# EAGLE board bms_master (EAGLE 6.2)
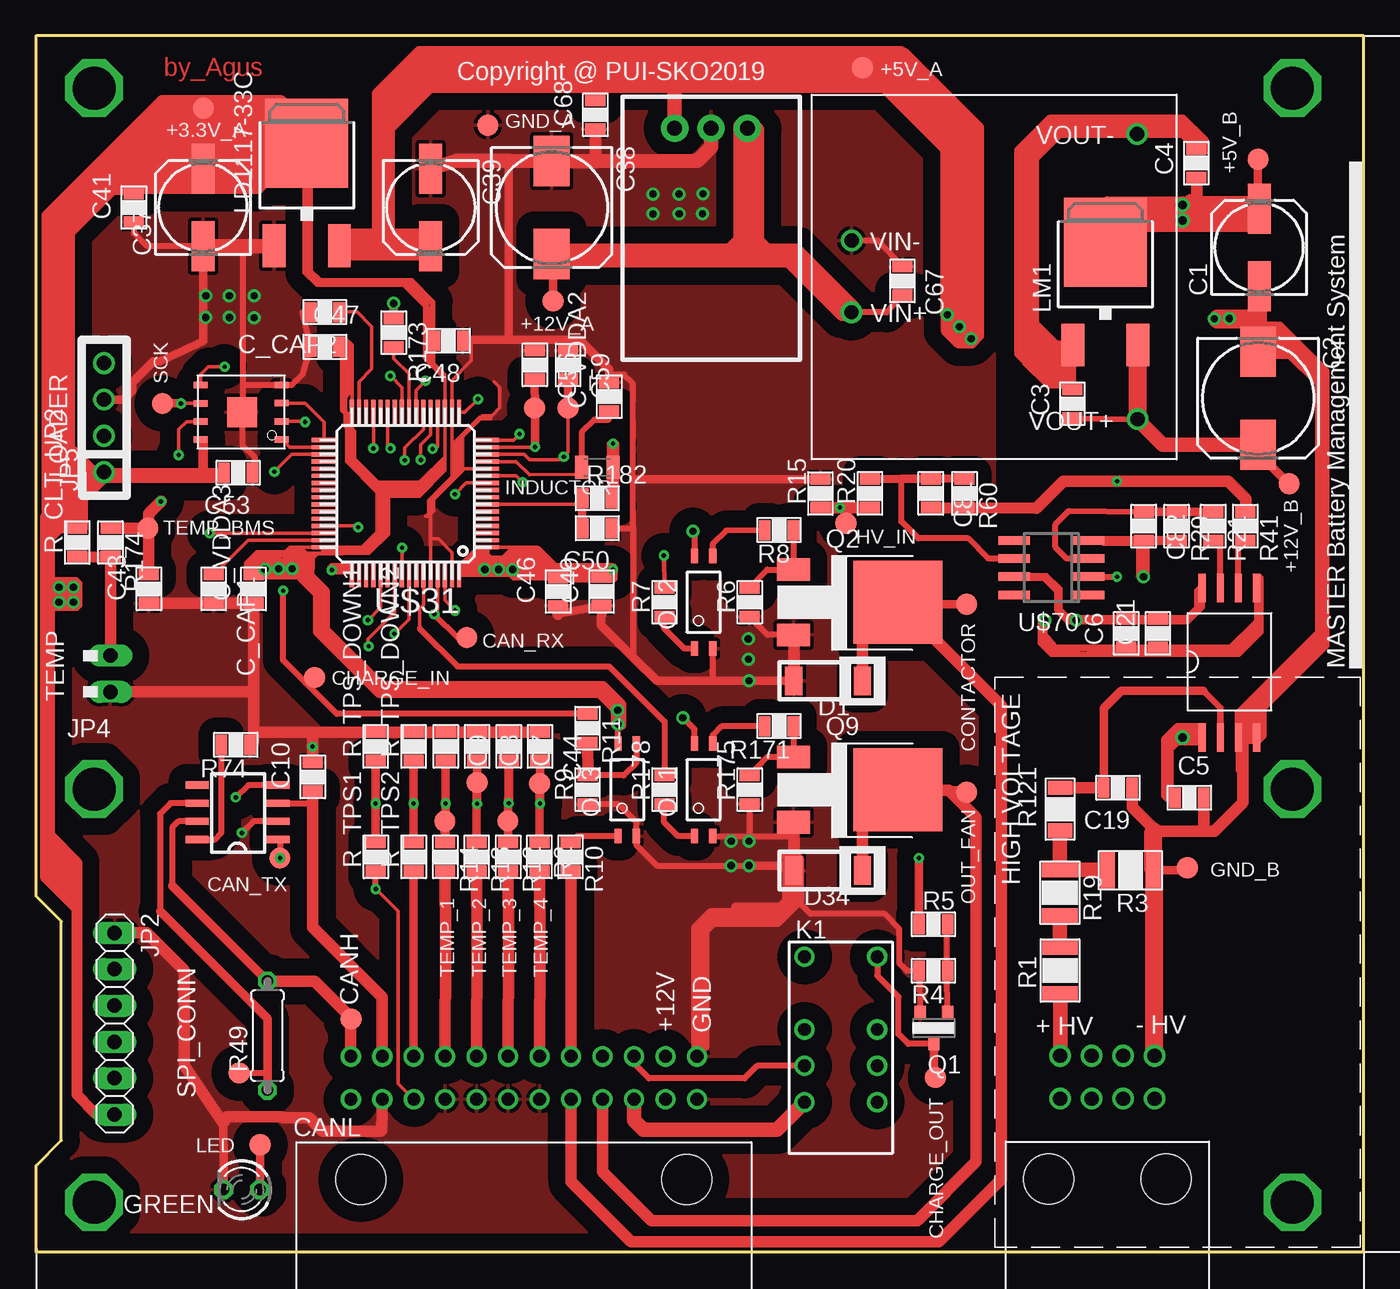
[diagram p1: board, top side]
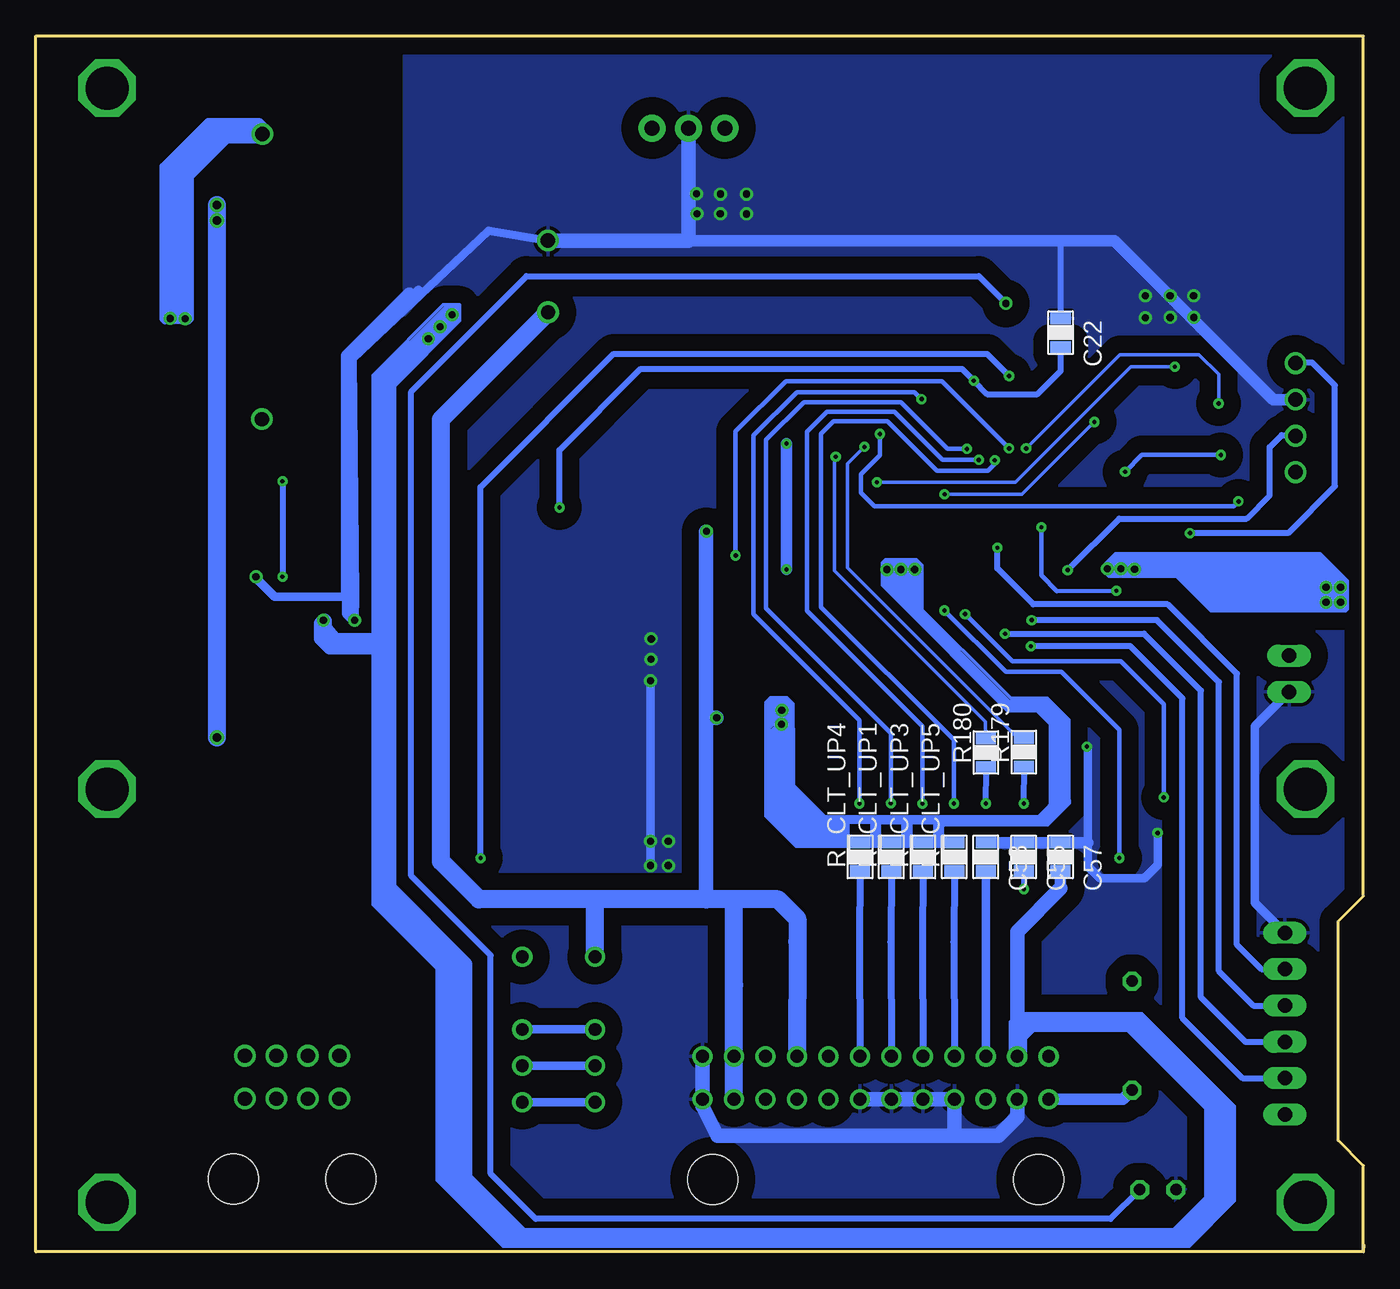
[diagram p2: board, bottom side, seen from below]

Size 92.86 x 85 mm. Coordinates in mm from the lower left corner, seen from the top.
Outline: 0,0.5 0.02,0
Outline: 0.02,0 92.86,0 92.86,84.99 0.02,85 0.02,24.86 1.78,23.1 1.78,7.79 0.02,6.03 0.02,0
Copper layers (1*16): Top 0.035mm / dielectric 1.5mm / Bottom 0.035mm
Design rules: minimum track width 10mil, minimum drill 24mil, track to track 8mil, track to pad 8mil, pad to pad 8mil, via to via 8mil, smd to smd 8mil, copper to edge 40mil, drill to drill 8mil, minimum pad ring 10mil, minimum via ring 8mil, stop-mask expansion 4mil, vias tented up to drill 0mil, thermal gap 10mil

## Footprints (pad centres in the part's own frame; a part is rotated, then mirrored left to right if it is on the bottom)
153CLV-0605 = smd 3.5 x 1.6: + 2.7,0; - -2.7,0
153CLV-0810 = smd 3.5 x 2.5: + 3.25,0; - -3.25,0
C_0805 = smd 0.813 x 1.4: 1 -1,0; 2 1,0
SOD80C = smd 1.2 x 2: A 2.4,0; C -2.4,0
LED3MM = drill 0.813 octagon: A -1.27,0; K 1.27,0
C0805K = smd 0.889 x 1.6: 1 -1.101,0; 2 1.096,0
1X06 = drill 1.016 long: 1 -6.35,0; 2 -3.81,0; 3 -1.27,0; 4 1.27,0; 5 3.81,0; 6 6.35,0
1X02/90 = drill 1.016 long: 1 -1.27,-3.81; 2 1.27,-3.81
1X04 = drill 1.016: 1 -3.81,0; 2 -1.27,0; 3 1.27,0; 4 3.81,0
HX = drill 0.9: 1 -6.35,-2.54; 3 -1.27,-2.54; 4 1.27,-2.54; 5 3.81,-2.54; 8 3.81,2.54; 9 1.27,2.54; 10 -1.27,2.54; 12 -6.35,2.54
DPACK@1 = smd 1.6 x 3: 1 -2.28,-4.8; 3 2.28,-4.8 | smd 5.8 x 6.2: 4 0,2.38
MINI-FLAT-4 = smd 1 x 0.5: 1 -3.24,0.635; 2 -3.24,-0.635; 3 3.24,-0.635; 4 3.24,0.635
SOT23 = smd 0.8 x 0.9: 1 -0.95,-1.1; 2 0.95,-1.1; 3 0,1.1
D-PAK_TO252AA = smd 1.6 x 2.3: 1 2.284,-4.8; 3 -2.29,-4.795 | smd 5.8 x 6.2: 4 0,2.5
R1210 = smd 1 x 2.5: 1 -1.6,0; 2 1.6,0
R_0805 = smd 0.813 x 1.4: 1 -1,0; 2 1,0
0207/7 = drill 0.813 octagon: 1 -3.81,0; 2 3.81,0
R_1210 = smd 1 x 1.7: 1 -1.5,0; 2 1.5,0
SN65HVD230 = smd 1.6 x 0.5: P$1 -2.97,1.8; P$2 -2.97,0.53; P$3 -2.97,-0.74; P$4 -2.97,-2.01; P$5 2.71,-2.01; P$6 2.71,-0.74; P$7 2.71,0.53; P$8 2.71,1.8
NWD5 = drill 1: +IN -10.02,-2.498; +VOUT 9.986,-9.973; -IN -10.011,2.509; -VOUT 9.963,9.97
8PIN = drill 1: 1 -3.067,-4.855; 2 -3.066,-7.856; 3 -0.867,-4.855; 4 -0.866,-7.856; 5 1.333,-4.855; 6 1.334,-7.856; 7 3.533,-4.855; 8 3.534,-7.856 | hole 3.5: -3.867,0.745; 4.333,0.745
24PIN = drill 0.9: 1 -11.957,-6.125; 2 -11.956,-9.126; 3 -9.757,-6.125; 4 -9.756,-9.126; 5 -7.557,-6.125; 6 -7.556,-9.126; 7 -5.357,-6.125; 8 -5.356,-9.126; 9 -3.157,-6.125; 10 -3.156,-9.126; 11 -0.957,-6.125; 12 -0.956,-9.126; 13 1.243,-6.125; 14 1.244,-9.126; 15 3.443,-6.125; 16 3.444,-9.126; 17 5.643,-6.125; 18 5.644,-9.126; 19 7.843,-6.125; 20 7.844,-9.126; 21 10.043,-6.125; 22 10.044,-9.126; 23 12.243,-6.125; 24 12.244,-9.126 | hole 3.5: -11.257,-0.525; 11.543,-0.525
TESTPOINT = smd 1.5 x 1.5: P$1 0,0
STRETCHSO8 = smd 2 x 0.5: P$1 -5.355,1.796; P$2 -5.355,0.526; P$3 -5.355,-0.744; P$4 -5.355,-2.014; P$5 5.075,-2.014; P$6 5.075,-0.744; P$7 5.075,0.526; P$8 5.075,1.796
MDC_OKI = drill 1.05 pad 1.9: 1 -2.54,0; 2 0,0; 3 2.54,0
TQFP64 = smd 1.7 x 0.3: 1 -5.7,3.75; 2 -5.7,3.25; 3 -5.7,2.75; 4 -5.7,2.25; 5 -5.7,1.75; 6 -5.7,1.25; 7 -5.7,0.75; 8 -5.7,0.25; 9 -5.7,-0.25; 10 -5.7,-0.75; 11 -5.7,-1.25; 12 -5.7,-1.75; 13 -5.7,-2.25; 14 -5.7,-2.75; 15 -5.7,-3.25; 16 -5.7,-3.75; 33 5.7,-3.75; 34 5.7,-3.25; 35 5.7,-2.75; 36 5.7,-2.25; 37 5.7,-1.75; 38 5.7,-1.25; 39 5.7,-0.75; 40 5.7,-0.25; 41 5.7,0.25; 42 5.7,0.75; 43 5.7,1.25; 44 5.7,1.75; 45 5.7,2.25; 46 5.7,2.75; 47 5.7,3.25; 48 5.7,3.75 | smd 0.3 x 1.7: 17 -3.75,-5.7; 18 -3.25,-5.7; 19 -2.75,-5.7; 20 -2.25,-5.7; 21 -1.75,-5.7; 22 -1.25,-5.7; 23 -0.75,-5.7; 24 -0.25,-5.7; 25 0.25,-5.7; 26 0.75,-5.7; 27 1.25,-5.7; 28 1.75,-5.7; 29 2.25,-5.7; 30 2.75,-5.7; 31 3.25,-5.7; 32 3.75,-5.7; 49 3.75,5.7; 50 3.25,5.7; 51 2.75,5.7; 52 2.25,5.7; 53 1.75,5.7; 54 1.25,5.7; 55 0.75,5.7; 56 0.25,5.7; 57 -0.25,5.7; 58 -0.75,5.7; 59 -1.25,5.7; 60 -1.75,5.7; 61 -2.25,5.7; 62 -2.75,5.7; 63 -3.25,5.7; 64 -3.75,5.7
8DFN = smd 0.45 x 1: P$1 0.629,0.211; P$2 1.899,0.211; P$3 3.169,0.211; P$4 4.439,0.211; P$5 4.425,5.88; P$6 3.155,5.88; P$7 1.885,5.88; P$8 0.615,5.88 | smd 2.1 x 2.1: P$9 2.535,2.968
SO-08 = smd 0.6 x 2.2: 1 -1.905,-2.6; 2 -0.635,-2.6; 3 0.635,-2.6; 4 1.905,-2.6; 5 1.905,2.6; 6 0.635,2.6; 7 -0.635,2.6; 8 -1.905,2.6

## Placement (x,y rotation side)
C1  [153CLV-0605]  85.55,70.2 90 top
C2  [153CLV-0810]  85.46,59.66 270 top
C3  100NF  [C_0805]  72.49,59.28 90 top
C4  100NF  [C_0805]  81.15,76.1 90 top
C5  100NF  [C_0805]  80.67,31.74 0 top
C6  100NF  [C_0805]  76.25,43.22 90 top
C7  100NF  [C_0805]  33.08,35.33 270 top
C8  100NF  [C_0805]  30.85,35.33 270 top
C9  100NF  [C_0805]  28.67,35.33 270 top
C10  100nF  [C_0805]  19.37,33.2 90 top
C19  100NF  [C_0805]  75.67,32.43 180 top
C21  100NF  [C_0805]  78.45,43.22 90 top
C22  100NF  [C_0805]  21.19,64.25 270 bottom
C37  [153CLV-0605]  11.7,73 90 top
C38  [153CLV-0810]  36.07,73 270 top
C39  [153CLV-0605]  27.61,73 270 top
C41  C_0805  [C_0805]  6.86,73 90 top
C43  100NF  [C_0805]  7.91,46.34 90 top
C44  100NF  [C_0805]  35.26,35.33 270 top
C46  1uf  [C_0805]  36.53,46.16 90 top
C47  1uf  [C_0805]  20.22,63.26 0 top
C48  1uf  [C_0805]  28.85,63.68 180 top
C49  1uf  [C_0805]  39.55,46.16 90 top
C50  100NF  [C_0805]  39.26,50.58 180 top
C53  100NF  [C_0805]  14.15,54.45 180 top
C55  100NF  [C_0805]  23.78,27.61 270 bottom
C56  100NF  [C_0805]  34.89,62 270 top
C57  100NF  [C_0805]  21.2,27.61 270 bottom
C58  100NF  [C_0805]  26.43,27.61 270 bottom
C59  100NF  [C_0805]  37.22,61.99 270 top
C67  100nF  [C_0805]  60.59,67.86 270 top
C68  100nF  [C_0805]  39.12,79.48 90 top
C81  100pf  [C_0805]  62.58,53.01 270 top
C82  100pf  [C_0805]  77.47,50.73 270 top
C_CAP1  1uf  [C_0805]  12.44,46.34 270 top
C_CAP2  1uf  [C_0805]  20.22,65.69 180 top
C_VDDA2  1uf  [C_0805]  40.1,59.78 90 top
C_VDDA3  1uf  [C_0805]  15.23,46.34 90 top
D1  [SOD80C]  55.4,39.91 180 top
D34  [SOD80C]  55.4,26.65 180 top
GREEN  [LED3MM]  14.4,4.35 180 top
INDUCTOR  2.2UH  [C0805K]  39.26,54.84 180 top
JP2  [1X06]  5.52,15.95 270 top
JP4  [1X02/90]  1.41,40.41 90 top
JP5  [1X04]  4.77,58.3 90 top
K1  HX2-12V  [HX]  56.3,14.27 270 top
LD1117-33C  [DPACK@1]  18.95,75.11 0 top
LM1  [DPACK@1]  74.79,68.19 0 top
OK1  TLP283  [MINI-FLAT-4]  46.7,32.3 90 top
OK2  TLP283  [MINI-FLAT-4]  46.7,45.4 90 top
OK3  TLP283  [MINI-FLAT-4]  41.36,32.3 90 top
Q1  BC848ALT1SMD  [SOT23]  62.8,15.64 180 top
Q2  IRF520  [D-PAK_TO252AA]  57.78,45.4 270 top
Q9  IRF520  [D-PAK_TO252AA]  57.78,32.3 270 top
R1  1M5  [R1210]  71.62,19.66 90 top
R2  100R  [R_0805]  35.22,27.61 270 top
R3  10K  [R1210]  76.55,26.68 180 top
R4  1K  [R_0805]  62.76,19.65 180 top
R5  100  [R_0805]  62.76,22.9 0 top
R6  4k7  [R_0805]  49.92,45.4 90 top
R7  330  [R_0805]  43.96,45.4 90 top
R8  1k  [R_0805]  51.98,50.45 180 top
R9  4k7  [R_0805]  38.58,32.3 90 top
R10  1K  [R_0805]  37.39,27.61 270 top
R11  100  [R_0805]  38.58,36.6 270 top
R12  100R  [R_0805]  33.03,27.61 270 top
R13  100R  [R_0805]  30.82,27.61 270 top
R14  100R  [R_0805]  28.63,27.61 270 top
R15  1K  [R_0805]  54.87,53.01 90 top
R19  1M5  [R1210]  71.61,25.1 270 top
R20  1K  [R_0805]  58.33,53.01 90 top
R21  10k  [R_0805]  82.33,50.73 270 top
R29  22k  [R_0805]  79.77,50.73 270 top
R41  10K  [R_0805]  84.58,50.73 270 top
R49  120  [0207/7]  16.2,15.11 90 top
R60  22K  [R_0805]  64.94,53.01 270 top
R74  10k  [R_0805]  13.99,35.44 180 top
R121  1K  [R_1210]  71.62,30.94 90 top
R171  1k  [R_0805]  51.98,36.75 180 top
R173  100  [R_0805]  25.03,64.25 270 top
R174  100R  [R_0805]  5.23,49.58 270 top
R175  4k7  [R_0805]  49.92,32.3 90 top
R178  330  [R_0805]  43.96,32.3 90 top
R179  100R  [R_0805]  23.77,34.93 90 bottom
R180  100R  [R_0805]  26.42,34.9 90 bottom
R182  10K  [R_0805]  39.26,52.68 0 top
R_CLT_UP1  10K  [R_0805]  33.03,27.61 90 bottom
R_CLT_UP2  10K  [R_0805]  2.9,49.58 90 top
R_CLT_UP3  10K  [R_0805]  30.82,27.61 90 bottom
R_CLT_UP4  10K  [R_0805]  35.22,27.61 90 bottom
R_CLT_UP5  10K  [R_0805]  28.63,27.61 90 bottom
R_TPS1  3K9  [R_0805]  23.78,27.61 90 top
R_TPS2  3K9  [R_0805]  26.43,27.61 90 top
R_TPS_DOWN1  6K8  [R_0805]  23.77,35.33 90 top
R_TPS_DOWN2  6K8  [R_0805]  26.42,35.33 90 top
U8  MCP2551  [SN65HVD230]  13.99,30.62 180 top
U$1  NWD5-12  [NWD5]  67.06,68.17 0 top
U$2  SOCKET8P  [8PIN]  75.16,5.85 180 top
U$3  SOCKET24P  [24PIN]  34.28,4.53 180 top
U$4  TESTPOINT  [TESTPOINT]  31.61,78.74 0 top
U$5  TESTPOINT  [TESTPOINT]  36.17,66.46 0 top
U$6  TESTPOINT  [TESTPOINT]  11.72,79.93 0 top
U$7  TESTPOINT  [TESTPOINT]  15.68,7.48 0 top
U$8  TESTPOINT  [TESTPOINT]  30.14,42.94 0 top
U$9  ACPL-C87B  [STRETCHSO8]  83.35,41.32 90 top
U$10  TESTPOINT  [TESTPOINT]  17.08,27.53 0 top
U$11  TESTPOINT  [TESTPOINT]  14.23,12.5 0 top
U$12  TESTPOINT  [TESTPOINT]  22.04,16.27 0 top
U$13  TESTPOINT  [TESTPOINT]  34.87,58.98 0 top
U$14  TESTPOINT  [TESTPOINT]  37.21,58.98 0 top
U$15  TESTPOINT  [TESTPOINT]  19.5,40.15 0 top
U$16  TESTPOINT  [TESTPOINT]  62.91,12.19 0 top
U$17  TESTPOINT  [TESTPOINT]  65.09,32.13 0 top
U$18  TESTPOINT  [TESTPOINT]  65.09,45.26 0 top
U$19  TESTPOINT  [TESTPOINT]  85.46,76.37 0 top
U$20  TESTPOINT  [TESTPOINT]  80.52,26.85 0 top
U$21  TESTPOINT  [TESTPOINT]  87.62,53.68 0 top
U$22  TESTPOINT  [TESTPOINT]  56.65,50.92 0 top
U$23  TESTPOINT  [TESTPOINT]  7.85,50.58 0 top
U$24  TESTPOINT  [TESTPOINT]  35.23,32.74 0 top
U$25  TESTPOINT  [TESTPOINT]  30.87,32.8 0 top
U$26  TESTPOINT  [TESTPOINT]  28.6,30.09 0 top
U$27  TESTPOINT  [TESTPOINT]  33.01,30.11 0 top
U$28  TESTPOINT  [TESTPOINT]  8.85,59.29 0 top
U$29  OKI-78SR-5  [MDC_OKI]  47.22,78.54 180 top
U$31  STM32F405  [TQFP64]  25.86,52.99 180 top
U$32  MR25H256  [8DFN]  17.41,56.15 90 top
U$35  TESTPOINT  [TESTPOINT]  57.81,82.77 0 top
U$70  OPA237  [SO-08]  71.02,47.83 90 top

## Tracks (layer width: path | path; a pad name or v marks a point on that pad's centre or on a via)
12V  (via drill 0.5)
  Top 0.406: C67.2 59.5,65.67 U$1.+IN | OK1.4 46.07,36.51 v45.24,37.33 | v45.95,50.36 46.07,50.24 OK2.4
  Top 0.61: 36.78,69.07 36.8,69.1 52.61,69.1 56.33,65.37 57.36,65.37 57.36,66.05 53.21,70.2 50.95,70.2 50.38,70.78 50.38,78.45 49.75,79.08 49.75,79.05 49.09,78.38 49.09,70.63 48.54,70.09 36.69,70.09 36.78,70.18 49.46,70.18 | 49.46,70.18 49.57,70.28 50.62,70.28 50.77,70.13 51.21,70.13 | 52.15,70.13 51.21,70.13 | 51.21,70.13 50.65,70.69 50.65,78.5 50.01,79.14 49.45,79.14 49.07,78.76 49.07,70.79 48.52,70.23 48.52,70.07 48.91,69.68 | 49.76,69.94 49.46,69.94 49.46,70.18 | U$5.P$1 36.17,69.64 C38.+
  Top 1: C38.+ 49.96,69.75 | 49.96,69.75 52.96,69.75 U$1.+IN | U$29.1 49.76,69.94 49.96,69.75
  Bottom 0.406: 45.98,50.33 v45.95,50.36 | v45.24,37.33 v45.25,37.32
  Bottom 1: 44.03,18.66 U$3.4 | 44.03,24.48 43.87,24.64 | 53.76,24.37 53.49,24.64 | 45.98,24.64 45.98,37.32 | 45.98,37.32 45.98,50.33 | v45.25,37.32 45.98,37.32
  Bottom 1.27: U$3.3 44.03,18.66 | U$3.4 44.03,24.48 | U$3.8 39.61,21.68 39.61,23.29 40.95,24.64 43.87,24.64 45.98,24.64 53.49,24.64 61.87,24.64 64.52,27.29 64.52,58.19 U$1.+IN | K1.1 53.76,24.37
AGND  (via drill 0.5)
  Top 0.406: 84.09,33.67 U$9.P$3 84.6,35.96 U$9.P$4 | 81.71,31.75 C5.2 | LM1.1 72.51,60.28 C3.2 | 72.31,60.53 70.8,60.53 69.14,62.19 69.14,77.52 70.92,79.3 80.22,79.3 81.81,77.72 81.81,76.94 81.76,76.9 81.76,77.22 79.95,79.03 70.65,79.03 68.6,76.99 68.6,62.78 70.58,60.81 72.23,60.81 72.17,60.87 72.17,62.26 71.97,62.07 71.97,60.88 71.82,61.03 70.58,61.03 68.84,62.76 68.84,65.54 68.86,65.53 69.53,65.53 69.42,65.42 69.42,62.52 70.64,61.31 71.68,61.31 71.67,61.32 71.67,63.08 70.09,64.66 69.62,64.66 69.69,64.59 69.69,62.42 70.44,61.67 71.43,61.67 71.38,61.72 71.38,63.05 70.13,64.3 69.89,64.3 69.97,64.22 69.97,62.4 70.47,61.9 71.08,61.9 71.15,61.97 71.15,62.92 70.2,63.87 70.2,63.89 70.3,63.78 70.3,62.49 70.64,62.16 70.88,62.16 70.86,62.17 70.86,62.81 70.5,63.17 70.5,63.19 70.61,63.08 70.61,62.48 70.35,62.73 70.35,63.17 69.42,64.1 69.42,76.46 71.49,78.52 80.21,78.52 80.59,78.14 80.45,78.14 | 80.45,78.14 79.75,78.84 70.87,78.84 68.82,76.79 68.82,65.39 68.74,65.32 68.74,75.99 71.34,78.59 70.97,78.59 70.94,78.56 | 70.94,78.56 | 70.94,78.56 69.13,76.75 | 80.45,78.14 80.45,77.88 80.45,77.87 | 82.41,64.82 87,64.82 90.24,61.58 90.24,42.37 85.84,37.96 85.84,36.05 85.49,35.7 84.75,35.7 84.4,36.05 84.4,36.81 84.3,36.9 84.05,36.9 84.05,37.69 89.68,43.32 89.68,60.92 88,62.6 86.7,62.6 86.64,62.66 86.64,64.14 86.93,64.43 | 86.93,64.43 | 86.93,64.43 89.95,61.4 89.95,42.42 85.67,38.14 85.67,36.03 85.64,36 85.06,36 84.84,36.23 84.84,38.07 85.17,38.4 85.17,36.19 85.08,36.09 85.08,36.44 84.62,36.9 84.62,37.78 84.56,37.84 84.56,37.75 84.4,37.58 84.4,37.11 84.44,37.07 84.41,37.07 84.32,36.97 84.32,37.19 89.7,42.56 89.7,60.59 87.56,62.73 87.56,62.87 86.76,63.66 86.76,63.15 87.18,62.73 86.98,62.73 86.92,62.66 86.92,64.66 86.78,64.8 85.95,64.8 85.89,64.87 85.89,65.9 85.98,65.99 85.3,65.99 85.22,65.92 85.22,65.06 85.11,64.94 85.11,65.6 85.13,65.63 82.46,65.63 82.24,65.41 82.24,65.06
  Top 0.406: 84.71,64.41 84.35,64.78 82.45,64.78 82.24,64.98 82.24,65.06 | v83.45,65.24 v83.45,65.23 83.46,65.21 | 82.24,65.06 v82.4,65.21
  Top 0.45: U$9.P$4 85.36,38.54 90.01,43.18 90.01,60.89 86.78,64.13 85.38,64.13 85.46,64.04 C2.-
  Top 0.6: U$1.-VOUT 71.57,78.14 69.85,76.42 69.85,64.88 71.34,63.39 LM1.1 | C2.- 85.55,62.91 C1.- 85.55,65.21 83.46,65.21 v82.4,65.21
  Top 0.61: U$1.-VOUT 80.21,78.14 80.45,77.87 C4.2 | U$20.P$1 80.52,26.68 R3.1
  Top 0.813: C19.1 76.67,31.09 78.37,29.39 | 78.37,29.39 81.67,29.39 | 81.67,29.39 82.4,29.39 84.4,31.39 84.4,36.48 84.6,36.28 84.6,35.96 | 78.15,29.39 78.37,29.39 | C5.2 81.67,29.39
  Top 1: 78.23,26.59 R3.1
  Top 1.27: U$2.2 78.23,26.59 | R3.1 78.15,29.39
  Bottom 0.406: 77.07,77.77 79.37,77.77 82.02,75.12 82.02,65.19 82.17,65.04 83.83,65.04 83.99,65.19 83.99,75.89 80.81,79.06 77.2,79.06 76.64,78.49 76.64,78.01 76.96,77.68 80.27,77.68 82.7,75.25 82.7,65.54 82.98,65.25 83.66,65.25 83.68,65.28 83.68,75.75 80.57,78.86 77.4,78.86 77.07,78.53 79.9,78.53 | 83.29,65.34 83.16,65.47 83.16,75.24 80.11,78.29 79.76,78.29 82.98,75.08 82.98,65.63 83.21,65.4 83.26,65.4 83.44,65.58 83.44,75.45 80.35,78.53 79.9,78.53 | 79.9,78.53 79.89,78.52 79.89,78.18 79.62,77.91
  Bottom 0.61: v82.4,65.21 82.4,75.13 79.62,77.91 79.39,78.14 U$1.-VOUT
AN_IN  (via drill 0.3)
  Top 0.254: v27.27,60.89 26.61,60.23 U$31.23
  Top 0.406: R20.1 56.26,52.01 v56.24,52.02
  Top 0.61: U$22.P$1 56.65,52.02 v56.24,52.02
  Top 0.813: R15.1 R20.1
  Bottom 0.254: 21.19,62.97 C22.2
  Bottom 0.406: v56.24,52.02 56.24,56.04 50.56,61.72 28.1,61.72 v27.27,60.89 26.34,59.96 22.8,59.96 21.19,61.57 C22.2
CAN_RX  (via drill 0.3)
  Top 0.254: U$31.61 28.11,44.9 v27.87,44.58
  Top 0.406: 13.98,31.77 v13.99,31.76 14.86,32.63 U8.P$4 | U$8.P$1 29.51,42.94 v27.87,44.58
  Bottom 0.305: v13.99,31.76 13.99,38.28 16.97,41.27 24.56,41.27 v27.87,44.58
CAN_TX  (via drill 0.3)
  Top 0.254: U$31.62 28.61,45.54 v29.32,44.83
  Top 0.406: U8.P$1 17.08,28.7 v17.08,27.53
  Top 0.61: U$10.P$1 v17.08,27.53
  Bottom 0.254: 29.31,44.82 v29.32,44.83
  Bottom 0.305: v17.08,27.53 17.08,36.48 21.13,40.53 25.02,40.53 29.31,44.82
CANH
  Top 0.406: U8.P$7 9.97,30.09 9.55,29.67 9.55,25.57 | U$12.P$1 22.04,15.94 22.03,15.93
  Top 0.61: 9.55,25.57 R49.2
  Top 0.813: R49.2 19.49,18.92 22.03,16.38 22.03,15.93 U$3.24
CANL
  Top 0.406: U8.P$6 9.43,31.36 8.68,30.61 8.68,23.79 | U$11.P$1 16.01,12.5 16.2,12.69
  Top 0.61: R49.1 16.2,12.69 16.2,16.28 8.68,23.79
  Bottom 0.813: U$3.23 16.84,10.66 R49.1
CSBI  (via drill 0.3)
  Top 0.254: U$31.53 24.11,45.04 v23.22,44.16
  Bottom 0.406: v23.22,44.16 14.47,44.16 10.13,39.82 10.13,19.62 7.72,17.22 JP2.3
CURRENT_1  (via drill 0.3)
  Top 0.254: 37.22,58.95 37.22,55.88 v36.92,55.58 36.7,55.36 34.52,55.36 34.14,55.74 U$31.14
  Top 0.406: U$14.P$1 37.21,58.96 37.22,58.95
  Top 0.61: C59.2 U$14.P$1
  Bottom 0.254: R180.2 26.45,37.05 37.02,47.61 37.02,55.48 v36.92,55.58
CURRENT_2  (via drill 0.3)
  Top 0.254: U$31.15 34.88,56.24 v34.91,56.27
  Top 0.61: C56.2 34.9,58.85 | 34.9,58.85 v34.91,56.27 | U$13.P$1 34.87,58.87 34.9,58.85
  Bottom 0.254: R179.2 24.25,35.97 36.09,47.8 36.09,55.09 v34.91,56.27
FAN  (via drill 0.3)
  Top 0.254: v24.8,56.16 24.61,56.32 U$31.27
  Top 0.305: R7.2 43.93,48.67 v43.92,48.67
  Bottom 0.305: v43.92,48.67 43.92,57.34 40.39,60.86 29.51,60.86 v24.8,56.16
GND  (via drill 0.3, 0.5)
  Top 0.254: U$31.12 29.16,54.74 29.11,54.79 | 29.11,54.79 29.11,53.86 27.61,52.36 27.61,49.84 | 29.11,54.79 U$31.18 29.11,60.93 30.45,62.27 30.45,63.48 C48.1 | U$31.60 27.61,49.84 | U$31.63 29.11,48.88 28.15,49.84 27.61,49.84 | 31.81,58.24 31.11,58.24 29.85,56.97 29.85,54.6 29.11,53.87 28.8,53.87 27.46,52.53 27.46,51.62 27.24,51.4 27.46,51.4 27.81,51.76 27.81,52.87 29.61,54.67 29.61,56.89 31.04,58.32 31.04,58.31 29.23,56.5 29.23,54.49 29.16,54.43 29.16,54.45 29.52,54.81 29.52,56.36 29.39,56.49 29.39,54.73 29.44,54.68 29.44,56.58 29.65,56.78 29.65,56.89 31.2,58.45 31.91,58.45 32.44,58.98 32.44,60.43 32.06,60.81 | 70.18,44.12 70.18,42.49 70.98,41.69 84.14,41.69 85.73,43.28 85.73,47.16 85.62,47.26 85.62,43.48 83.98,41.83 71.06,41.83 70.28,42.61 70.28,44.14 70.36,44.21 | 70.36,44.21 70.36,42.76 71.15,41.97 71.15,42.23 71.06,42.31 | 70.54,42.83 71.06,42.31 | 71.06,42.31 83.88,42.31 85.38,43.82 85.51,43.82 83.64,41.95 83.64,41.85 83.81,42.02 84.08,42.02 85.47,43.42 85.47,43.64 83.92,42.09 83.92,41.88 83.84,41.96 73.6,41.96 | 70.36,44.21 70.5,44.21 v70.56,44.15 | 74.49,49.61 74.63,49.47 77.38,49.47 77.21,49.31 77.21,47.21 77.35,47.08 77.47,47.08 77.59,47.2 | 77.59,47.2 77.64,47.24 77.76,47.24 77.65,47.35 77.65,49.47 77.7,49.52 | 78.94,49.52 80.13,49.52 80.13,49.85 80.07,49.92 74.2,49.92 74.4,49.72 79.14,49.72 78.94,49.52 | 78.94,49.52 77.7,49.52 | 77.7,49.52 77.77,49.44 77.77,47.17 77.65,47.04 77.47,47.04 77.41,47.11 77.14,47.11 77.05,47.2 77.05,49.4 | v77.46,47.2 77.59,47.2
  Top 0.305: v77.46,47.2 77.47,47.21 C82.2 79.67,49.63 R29.2
  Top 0.406: U$70.4 77.43,49.73 C82.2 | R29.2 arc-90 R29.2 | U$9.P$5 85.36,44.06 83.46,42.15 C21.1 C6.1 71.4,42.12 70.56,43.12 v70.56,44.15 | Q1.2 61.81,19.53 R4.2 60.94,19.62 60.38,20.18 60.38,22.56 59.35,23.61 54.18,23.61 53,24.8 | 49.87,29.06 OK1.2 47.36,29.03 | 49.87,29.06 52.85,29.06 53,28.91 | R175.1 49.89,29.08 49.87,29.06 | R9.1 38.58,31.27 40.76,31.27 41.99,30.04 OK3.2 41.99,28.43 43.42,27 v49.87,27 | C37.- 7.77,70.3 6.87,71.19 6.87,71.88 C41.1 | C53.1 15.29,54.49 15.29,55.54 14.44,56.39 U$32.P$9 14.49,58.74 14.49,60.59 | C67.1 58.88,70.68 U$1.-IN | C59.1 37.22,63.72 37.19,63.75 | C56.1 34.89,63.66 34.98,63.75 | 32.53,63.72 32.5,63.75 | OK2.2 47.34,39.98 47.27,39.91 | Q2.1 51.17,43.12 R6.1 | C_VDDA2.2 40.1,61.32 41.14,61.32 41.76,60.7 41.76,53.91 41.76,50.49 41.67,50.58 C50.1 41.76,50.58 41.76,41.57 41.9,41.43 | C_CAP2.2 18.65,65.67 C47.1 18.65,61.32 17.92,60.59 U$32.P$4 14.49,60.59 | 14.49,60.59 14.49,70.3 | 14.49,70.3 | U8.P$2 15.22,30.09 v14.41,29.28
  Top 0.61: JP5.3 6.18,59.57 6.75,60.14 6.75,60.74 8.26,62.25 8.7,62.25 11.7,63.64 C37.- | C_VDDA2.2 40.1,61.68 38.02,63.75 37.19,63.75 34.98,63.75 | C48.1 30.49,63.75 32.5,63.75 33.06,63.75 | D1.A v49.87,39.91 47.27,39.91 43.42,39.91 41.9,41.43 39.53,43.8 39.53,44.57 C49.1 | 39.62,44.53 C49.1 | C49.1 36.53,44.59 C46.1 | 33.06,63.75 33.06,76.25 | 34.89,63.66 34.81,63.75 33.06,63.75 | D34.A 52.65,27 | 52.65,27 v49.87,27 | 53,27.3 52.7,27 52.65,27 | GREEN.K 13.13,6.18 13.11,9 | R15.2 41.86,54.01 41.76,53.91 | 46.13,13.65 46.24,13.76 | 46.24,13.76 46.79,14.31 46.79,22.44 47.36,23 51.86,23 53.44,24.58 53.44,27.44 53.28,27.6 52.43,27.6 52.49,27.54 52.49,24.55 52.05,24.11 48.93,24.11 | U$3.2 46.24,13.67 46.24,13.76
  Top 0.8: U$3.2 46.23,22.63 47.23,23.63 51.84,23.63 53,24.8 D34.A | 53,27.3 53,28.91 53,30 Q9.1 | 53,43.1 Q2.1
  Top 0.813: C46.1 36.53,44.56 | U$3.21 24.23,9.8 24.17,8.5 24.1,8.43 20.05,8.43 19.11,9.38 17.27,9.38 17.19,9.46 13.33,9.46 13.11,9 10.37,13.05 10.37,19.68 7.75,22.3 JP2.1 | 53,43.1 D1.A | C44.1 C7.1 C8.1 C9.1 R_TPS_DOWN2.2 R_TPS_DOWN1.2 19.24,36.33 | C68.1 39.12,76.27 39.15,76.25 | 19.24,36.33 15.25,36.33 15.23,36.34 | 15.23,38.99 C_VDDA3.1 C_CAP1.2 C43.1 | 15.23,38.99 15.23,36.34 | 15.23,36.34 15.23,35.67 R74.1 | C10.2 v19.37,35.32 19.37,36.2 19.24,36.33 | JP4.1 15.08,39.14 15.23,38.99
  Top 1: C39.- 29.44,76.25 33.06,76.25 C38.- 39.15,76.25 46.01,76.25 46.27,76.25 47.22,77.19 U$29.2 | LD1117-33C.1 14.49,70.3 C37.-
  Bottom 0.254: 23.27,70.52 23.1,70.68
  Bottom 0.406: C22.1 21.19,70.68 20.8,70.68 | v77.46,47.2 76.11,45.85 70.51,45.82
  Bottom 0.61: JP4.1 7.63,36.73 7.63,24.41 JP2.1 | v49.87,27 v49.87,39.91 | U$1.-IN 61.21,71.36 70.69,62.42 70.51,45.82 v70.56,44.15 | v14.41,29.28 14.41,27.07 15.36,26.13 18.47,26.13 19.31,26.96 19.31,28.61 19.31,35.32 v19.37,35.32 | 66.07,67.23 71.01,62.3 71.01,44.63 70.8,44.42 70.8,44.24 71.17,44.61 71.17,62.62 66.69,67.1 66.78,67.1 71.21,62.67 71.21,45.83 71.24,45.79 76.17,45.79 77.5,47.12
  Bottom 0.813: U$1.-IN 23.1,70.68 20.8,70.68 17.44,70.68 6.33,59.57 JP5.3 | C58.1 C55.1 C57.1 19.31,28.6 19.31,28.61
  Bottom 1: 28.63,8.13 45.2,8.13 46.23,10.16 U$3.1 46.23,12.66 U$3.2 | 28.63,8.13 25.53,8.13 24.23,9.43 U$3.21 | 28.63,8.13 U$3.17 U$3.15 U$3.13 U$3.11 | U$29.2 47.22,70.68 U$1.-IN
  other vias: 49.84,41.42 49.82,42.84 49.87,28.7 48.63,28.7 48.63,27 46.62,72.57 44.99,72.57 43.16,72.55 43.16,73.94 44.97,73.94 46.65,73.96 15.26,66.82 13.54,66.82 13.54,65.31 15.27,65.29 11.89,65.31 11.9,66.82
  pour Top (isolate 1.2): 0.03,0.01 67.05,0.01 67.05,40.2 67.05,85.04 -0.22,85.04 -0.22,0.01 0.01,0.01
  pour Bottom (isolate 1.2): 0.04,0.01 67.05,0.01 67.05,85.04 -0.21,85.04 -0.21,0.02 0.02,0.02
HOLD  (via drill 0.3)
  Top 0.254: U$32.P$7 10.55,58.04 10,57.49 v10,55.7 v9.99,55.7 | U$31.35 17.9,55.74 v16.68,54.52
  Bottom 0.305: v9.99,55.7 15.5,55.7 v16.68,54.52
HV
  Top 1: U$2.8 71.63,18.05 R1.1
N$3
  Top 0.406: R8.1 Q2.3 51.14,47.69 R6.2
N$4
  Top 0.406: K1.12 58.84,19.3 60.32,17.82 60.32,17.8 60.32,15.23 61,14.54 Q1.3
  Top 0.61: U$16.P$1 62.8,12.29 Q1.3
N$5
  Top 0.406: OK2.1 45.34,42.16 43.93,43.57 R7.1
N$6
  Top 0.45: U$9.P$2 82.82,38.02 81.63,39.21
  Top 0.61: 81.63,39.21 75.89,39.21 74.67,37.99 C19.2
  Top 0.813: R121.2 C19.2
N$7
  Top 0.406: R8.2 48.28,50.42 47.34,49.48 OK2.3
N$8
  Top 0.406: U$9.P$7 82.82,49.69 R21.2
N$9
  Top 0.406: Q1.1 63.71,19.62 | 63.71,19.62 63.71,22.84 R5.2 | R4.1 63.72,19.62 63.71,19.62
N$10
  Bottom 0.6: K1.10 K1.3
N$11  (via drill 0.3)
  Top 0.406: U$70.2 v75.6,47.19 arc-90 v75.61,47.19 | 62.64,51.97 arc90 C81.2
  Top 0.813: R41.1 84.61,52.65 83.39,53.87 v75.61,53.87 71.86,53.87 69.97,51.97 R60.2 62.64,51.97
  Bottom 0.406: v75.61,53.87 v75.61,47.19
N$14
  Top 0.406: U$9.P$6 84.09,49.69 R41.2
N$15
  Top 0.406: OK3.1 37.88,29.06 R10.1
N$16
  Top 0.406: 77.5,51.73 C82.1 72.25,51.8 71.3,50.85 71.3,49.26 72.1,48.46 U$70.3
  Top 0.61: R21.1 R29.1 77.5,51.73
N$17
  Top 0.406: 38.61,33.4 R9.2 41.1,33.31 41.99,34.2 OK3.3
  Top 0.813: R11.2 38.61,33.4
N$18
  Top 1: R3.2 74.92,26.7 R19.1 71.62,26.71 R121.1
N$21
  Top 0.61: 21.5,69.69 21.6,69.6 27.72,69.6 26.35,70.96 21.58,70.96 21.7,71.09 27.21,71.09 27.08,71.22 21.81,71.22 21.87,71.16 24.33,71.16 23.99,71.5 23.99,78.62 29.21,83.84 60.77,83.84 66.01,78.6 66.01,63.99 65.47,63.45 65.47,63.55 63.58,65.44 63.58,64.37 64.52,63.43 65.38,63.43 65.47,63.53 65.47,78.35 60.55,83.27 27.91,83.27 23.86,79.23 23.86,70.83 24.36,70.34 24.36,78.7 23.79,79.26 23.79,80.97 26.81,83.99 60.55,83.99 65.08,79.45 65.08,64.21 64.67,63.8 64.67,63.65 64.1,64.21 64.1,64.56 64.18,64.63 64.18,78.02 64.36,78.21 64.36,78.58 64.55,78.39 64.55,64.63 64.29,64.9 64.29,78.89 60.28,82.89 28.55,82.89 28.52,82.93 28.52,83.65 28.36,83.5 26.66,83.5 23.8,80.63 23.8,70.84 24.27,71.32 24.27,80.44 26.84,83.01 27.48,83.01 27.74,82.75 27.74,82.04 27.81,81.98 59.8,81.98 63.77,78.01 63.77,77.79 63.92,77.94 63.92,78.71 60.2,82.43 27.85,82.43 28.27,82.01 60.72,82.01
N$23
  Top 0.406: U8.P$8 12.49,28.82 12.99,29.32 R74.2
N$71
  Top 1: R1.2 71.62,23.49 R19.2
N$154
  Top 0.254: U$31.47 14.85,49.74 C_CAP1.1
N$155
  Top 0.254: U$31.31 22.61,60.82 23.5,61.71 23.5,64.67 22.47,65.7 21.9,65.7 C_CAP2.1
N$156
  Top 0.254: U$31.24 26.11,61.36 25.03,62.44 25.03,63.18 R173.2
N$157  (via drill 0.5)
  Top 0.61: v25.02,66.29 25.02,65.3 R173.1 | U$7.P$1 15.68,4.36 GREEN.A
  Bottom 0.406: v25.02,66.29 26.92,68.19 58.54,68.19 66.61,60.13 66.61,26.28 61.05,20.72 61.05,5.45 57.9,2.3 17.72,2.3 GREEN.A
N$158
  Top 0.406: JP4.2 5.26,41.71 | R_CLT_UP2.1 2.9,48.55
  Top 0.813: 5.26,41.71 R174.2 2.9,48.55
N$163  (via drill 0.3)
  Top 0.61: R_TPS_DOWN1.1 v23.77,31.33 23.77,29.39 R_TPS1.2
  Bottom 0.406: R179.1 23.8,31.37 v23.77,31.33
N$165  (via drill 0.3)
  Top 0.61: R_TPS_DOWN2.1 v26.42,31.33 26.42,29.39 R_TPS2.2
  Bottom 0.406: R180.1 26.45,31.19 v26.42,31.33
N$169
  Top 0.406: R171.1 Q9.3 51.14,34.59 R175.2
N$170
  Top 0.406: OK1.1 44.91,29.06 43.93,30.04 R178.1
N$173
  Top 0.406: R171.2 47.95,36.72 47.34,36.11 OK1.3
N$611  (via drill 3)
  other vias: 87.87,3.47
N$612  (via drill 3)
  other vias: 4.08,3.47
N$615  (via drill 3)
  other vias: 4.07,81.34
N$616  (via drill 3)
  other vias: 4.07,32.34
N$617  (via drill 3)
  other vias: 87.86,32.34
N$618  (via drill 3)
  other vias: 87.86,81.34
N$1065
  Top 0.254: U$31.13 33.6,55.24 34.51,54.33 37.9,54.34 38.21,54.65
  Top 0.406: 38.21,54.65 38.21,54.86 | 38.21,54.86 38.21,57.33 39.06,58.18 40.06,58.18 C_VDDA2.1 | INDUCTOR.2 38.19,54.84 38.21,54.86
NRST
  Top 0.254: U$31.7 38.15,52.25 38.21,52.19
  Top 0.406: R182.1 38.26,52.53 38.26,52.36 38.17,52.26 38.15,52.25
  Top 0.61: 38.17,52.26 C50.2
PA3  (via drill 0.3)
  Top 0.254: v30.92,59.61 30,58.69 U$31.17
  Top 0.305: C44.2 35.26,34.23
  Top 0.406: C44.2 35.25,34.23
  Top 0.61: 35.25,34.23 35.24,32.76 | 35.24,32.76 R2.1 | 35.26,34.23 v35.26,31.34 | U$24.P$1 35.23,32.76 35.24,32.76
  Bottom 0.305: v35.26,31.34 35.26,37.17 42.66,44.57 42.66,57.07 39.63,60.09 31.4,60.09 v30.92,59.61
PA4  (via drill 0.3)
  Top 0.254: v27.75,56.13 28.11,56.29 U$31.20
  Top 0.305: 33.08,31.36 v33.07,31.35
  Top 0.406: C7.2 33.06,34.19
  Top 0.61: 33.06,34.19 33.04,29.34 | 33.04,29.34 R12.1 | C7.2 33.08,31.36 | U$27.P$1 33.01,29.34 33.04,29.34
  Bottom 0.305: v33.07,31.35 33.07,36.26 41.78,44.97 41.78,56.76 39.15,59.39 32.37,59.39 29.11,56.13 v27.75,56.13
PA5  (via drill 0.3)
  Top 0.254: C8.2 30.85,34.23 | U$31.21 27.61,57.09 26.92,56.41 v26.92,55.35
  Top 0.406: C8.2 30.85,34.23
  Top 0.61: 30.85,34.23 30.84,32.43 | 30.84,32.43 R13.1 | 30.85,34.23 v30.85,31.32 | U$25.P$1 30.87,32.43 30.84,32.43
  Bottom 0.305: v30.85,31.32 30.85,36.75 38.93,44.83 38.93,57.33 37.53,58.73 32.83,58.73 29.45,55.35 v26.92,55.35
PA6  (via drill 0.3)
  Top 0.254: U$31.22 27.11,57.49 25.8,56.19 v25.8,55.33
  Top 0.305: v28.67,31.33 v28.66,31.33
  Top 0.406: C9.2 28.67,34.23
  Top 0.61: 28.67,34.23 28.64,29.32 | 28.64,29.32 R14.1 | C9.2 v28.67,31.33 | U$26.P$1 28.6,29.32 28.64,29.32
  Bottom 0.305: v28.66,31.33 28.66,35.79 37.94,45.07 37.94,57.19 37.09,58.04 33.3,58.04 29.85,54.59 26.29,54.59 25.8,55.09 v25.8,55.33
PA12  (via drill 0.3)
  Top 0.254: v22.54,50.65 22.45,50.74 U$31.45
  Top 0.406: R11.1 21.04,37.6 18.9,39.74 | 18.9,39.74 17.29,41.35 v17.29,46.2 | U$15.P$1 19.32,40.15 18.9,39.74
  Bottom 0.305: v17.29,46.2 21.44,46.19 22.55,47.29 22.55,50.64 v22.54,50.65
PB7
  Top 0.254: 26.85,43.56 26.85,44.99 27.11,45.24 U$31.59
  Top 0.406: 26.85,43.56 29.49,40.93 40.09,40.93 43.96,37.06 R178.2
PB10  (via drill 0.3)
  Top 0.254: U$32.P$6 v10.15,59.31 v10.15,59.3 | U$31.29 v23.61,56.16 v23.6,56.16
  Top 0.61: U$28.P$1 8.85,59.3 v10.15,59.3
  Bottom 0.254: v10.15,59.3 10.15,61.33 11.54,62.72 17.04,62.72 v23.6,56.16
PB13
  Top 0.254: U$31.34 17.74,56.24 U$32.P$1
PC2  (via drill 0.3)
  Top 0.254: U$32.P$2 18.84,58.05 v18.84,58.01 | U$31.10 30.1,53.74 v29.31,52.95
  Bottom 0.254: v18.84,58.01 23.89,52.95 v29.31,52.95
PC3  (via drill 0.3)
  Top 0.254: 13.17,61.84 v13.2,61.87 12.07,61.87 11.53,61.33 U$32.P$5 | v34.04,53.8 33.59,54.24 U$31.11
  Bottom 0.254: v34.04,53.8 24.35,53.8 16.27,61.87 v13.2,61.87
PC5  (via drill 0.3)
  Top 0.254: v24.8,61.22 25.61,60.41 U$31.25
  Top 0.61: R5.1 61.76,26.08 v61.76,27.52
  Bottom 0.406: v24.8,61.22 26.34,62.76 52.45,62.76 61.76,53.46 v61.76,27.52
S5
  Top 1: U$3.5 41.83,9.19 42.5,8.52 51.81,8.52 K1.5
  Bottom 0.6: K1.8 K1.5
S6
  Top 0.406: K1.4 50.43,13 49.56,12.13 42.87,12.13 41.9,13.1 41.9,13.59 U$3.6
  Bottom 0.6: K1.9 K1.4
S7
  Top 0.61: U$17.P$1 64.95,32.27 63.65,32.27
  Top 0.8: D34.C 57.8,29.82 60.24,32.27 Q9.4 | U$3.7 39.63,5.6 43.06,2.18 61.64,2.18 65.75,6.29
  Top 0.813: 60.24,32.27 63.65,32.27 63.87,32.27 65.75,30.38 65.75,6.29
S9
  Top 0.61: U$18.P$1 60.42,45.26 arc-90 Q2.4
  Top 0.8: 37.43,5.11 37.43,4.89 41.6,0.71 63.13,0.71 67.51,5.09
  Top 0.813: 67.51,5.09 67.51,38.17 Q2.4 arc90 60.01,45.14 60.01,44.97 arc90 57.8,42.76 D1.C | 37.43,5.11 U$3.9
S10
  Top 0.61: R10.2 37.43,26.57
  Top 0.813: 37.43,26.57 U$3.10
S12
  Top 0.813: R2.2 35.25,21.66 U$3.12
  Bottom 0.5: R2.2 35.25,21.66 U$3.12
S14
  Top 0.813: R12.2 33.06,21.66 U$3.14
  Bottom 0.5: R12.2 33.06,21.66 U$3.14
S16
  Top 0.813: R13.2 30.85,21.66 U$3.16
  Bottom 0.5: R13.2 30.85,21.66 U$3.16
S18
  Top 0.813: R14.2 28.67,21.66 U$3.18
  Bottom 0.5: R14.2 28.67,21.66 U$3.18
S19  (via drill 0.3)
  Top 0.254: v23.78,25.36 25.33,23.8 25.33,11.76 U$3.19
  Top 0.406: v23.78,25.36 C55.2
  Bottom 0.406: C55.2 v23.78,25.36
S20
  Top 0.61: C58.2 26.43,21.66 U$3.20
  Bottom 0.61: C58.2 26.43,21.66 U$3.20
SCK  (via drill 0.3)
  Top 0.254: U$31.55 25.11,44.7 23.26,42.85 23.26,42.35 v23.27,42.33
  Bottom 0.406: v23.27,42.33 16.33,42.33 12.68,38.69 12.68,16.34 8.48,12.14 JP2.5
SDI  (via drill 0.3)
  Top 0.254: U$31.57 26.11,44.23 v25.08,43.21
  Bottom 0.406: v25.08,43.21 15.36,43.21 11.38,39.23 11.38,17.78 8.28,14.68 JP2.4
SDO  (via drill 0.3)
  Top 0.254: U$31.56 25.61,49.23 v25.62,49.21
  Bottom 0.406: v25.62,49.21 25.63,49.19 25.63,47.78 23.11,45.26 13.71,45.26 8.86,40.41 8.86,21.46 7.16,19.76 JP2.2
SWDCLK  (via drill 0.3)
  Top 0.254: U$31.49 22.11,47.84 22.09,47.86 20.69,47.86 v20.71,47.65 20.72,47.65 20.73,47.64 22.11,47.64 22.12,47.65 22.12,48.02 22.12,48.03 20.65,48.03 20.5,47.88 20.5,47.58 20.63,47.45 22.11,47.45
  Bottom 0.406: JP5.2 4.82,57.08 5.75,57.08 6.57,56.25 6.57,52.87 8.19,51.25 17.1,51.25 v20.71,47.65
SWDIO  (via drill 0.3)
  Top 0.254: U$31.46 v12.15,50.24 arc90 v12.15,50.24
  Bottom 0.406: JP5.4 4.72,62.16 3.6,62.16 2.01,60.57 2.01,53.51 5.29,50.24 v12.15,50.24
TEMP_BMS  (via drill 0.3)
  Top 0.254: v33.83,57.16 33.41,56.74 U$31.16
  Top 0.305: 7.88,50.59 arc-90 7.91,50.55
  Top 0.61: U$23.P$1 7.88,50.59
  Top 0.813: C43.2 7.91,50.55 7.91,51.6 v8.76,52.45 | R174.1 7.88,50.59
  Bottom 0.305: v33.83,57.16 33.83,55.68 35.16,54.36 35.16,53.05 34.22,52.12 9.1,52.12 v8.76,52.45
VCC  (via drill 0.5)
  Top 0.254: 69.4,47.07 70.5,47.07 71.41,46.16 71.41,44.69 72.15,43.96 80.59,43.96 81.64,45.01 81.64,46.26 81.43,46.47 81.32,46.47 81.11,46.25 81.11,45.06 80.45,44.4 72.22,44.4 71.66,44.96 71.66,46.38 70.7,47.34 68.4,47.34 68.26,47.2 68.44,47.02 70.45,47.02 71.32,46.15 71.32,44.85 71.52,44.65 | 71.52,44.65 72.08,44.09 72.82,44.09 72.84,44.11 80.47,44.11 81.28,44.92 81.28,46.26 81.3,46.25 81.3,45.17 80.31,44.19 79.3,44.19 | 71.44,44.75 71.52,44.75 71.52,44.65 | U$35.P$1 57.81,81.53 57.77,81.5
  Top 0.406: U$70.7 70.56,47.18 71.44,46.3 71.44,44.75 v72.74,44.13 76.38,44.13 | 76.38,44.13 78.49,44.13 | 78.49,44.13 80.62,44.13 81.55,45.07 U$9.P$8 | C6.2 76.38,44.13 | C21.2 78.49,44.22 78.49,44.13 | 24.29,70.3 24.13,70.3 | U8.P$3 19.3,31.36 arc-90 19.37,31.29
  Top 0.813: C10.1 19.37,31.29 19.37,22.67 24.23,17.81 U$3.22 | C68.2 39.12,81.5
  Top 1: LD1117-33C.3 21.25,70.3 24.13,70.3 24.44,70.3 | 24.44,70.3 C39.+ | v63.73,65.5 63.73,77.13 59.36,81.5 57.77,81.5 44.68,81.5 | 44.68,81.5 39.12,81.5 27.52,81.5 24.6,78.58 24.6,70.45 24.44,70.3 | U$29.3 44.68,81.5
  Bottom 0.254: 63.21,65.42 63.21,65.07 67.78,60.5 67.78,25.47 65.16,22.84 65.35,22.84 68.26,25.75 68.26,60.23 63.21,65.28 63.21,66.18 64.36,66.18 69.27,61.27 69.27,24.26 64.79,19.78 64.79,5 60.19,0.4 12.21,0.4 9.05,3.57 9.05,10.18 15.51,16.64 24.17,16.64 24.72,16.09 24.72,13.57 24.37,13.22 23.93,13.22 23.64,13.51 23.64,14.89 23.05,15.48 16.52,15.48 11.03,9.99 11.03,3.69 13.11,1.61 12.49,1.61 10.49,3.62
  Bottom 0.406: v72.74,44.13 71.83,43.06 68.37,43.06
  Bottom 0.61: 10.49,3.62 10.27,3.84 10.27,9.82 10.56,10.12 10.69,10.12 10.72,10.09 10.72,4 10.77,4.06 10.77,10.3 16.19,15.72 23.44,15.72 23.87,15.29 23.87,15.03 23.37,15.52 23.37,15.54 22.94,15.98 15.88,15.98 9.36,9.46 9.36,3.66 12.36,0.66 12.86,0.66 9.62,3.89 | 9.62,3.89 | 9.62,3.89 12.82,0.69 60.04,0.69 64.5,5.15 64.58,5.15 64.24,5.49 63.74,5.49 59.55,1.3 59.55,0.99 63.94,5.37 64.06,5.37 63.8,5.64 63.43,5.64 63.41,5.66 63.41,19.98 68.89,25.46 68.95,25.46 68.97,25.45 68.97,24.34 64.49,19.87 64.49,5.31 64.03,5.77 64.03,5.85 64.11,5.92 64.11,20.11 63.84,19.85 63.58,19.85 63.76,19.67 63.76,5.76 64.12,6.12 64.12,20.02 68.93,24.84 68.93,61.03 64.07,65.9 63.51,65.9 63.42,65.99 63.42,65.94 68.74,60.61 68.74,42.05 72.33,42.05 73.1,42.82 73.1,43.96 72.75,44.31 72.63,44.31 72.45,44.13 72.45,42.89 72.57,42.77 72.57,43.63 72.75,43.81 72.75,43 72.23,42.47 72.23,42.89 72.19,42.93 69.55,42.93 69.4,42.78 69.4,42.34 69.44,42.29 71.81,42.29 71.98,42.46 71.79,42.46 71.7,42.56 69.87,42.56 69.85,42.58 | v65.4,63.83 65.45,63.83 65.45,63.78 | v64.59,64.65 64.65,64.65 64.65,64.58 | 68.37,25.66 68.26,25.66 68.26,25.75
  Bottom 0.813: 21.2,25.4 C57.2
  Bottom 1: v63.73,65.5 64.65,64.58 65.45,63.78 68.37,60.86 68.37,43.06 68.37,25.66 62.83,20.11 62.83,5.13 58.86,1.17 13.15,1.17 9.65,4.67 9.65,9.94 15.77,16.06 24.23,16.06 | U$3.22 24.23,16.06 | 24.23,16.06 24.23,22.37 21.2,25.4
VCCIO  (via drill 0.6)
  Top 0.305: 79.59,31.21 79.02,31.78 79.02,35.19 80.13,36.29 81.38,36.29 81.34,36.34 81.34,36.82 79.79,36.82 78.85,35.88 78.85,31.85 79.35,31.35 79.35,35.07 78.97,35.46 78.97,35.75 79.06,35.84 79.12,35.84 79.87,36.59 81.21,36.59 81.3,36.5 80.05,36.5 79.97,36.41 79.96,36.41 79.14,35.59 81.09,35.59 81.34,35.84 81.34,35.62 81.27,35.55 79.72,35.55 79.37,35.19 79.37,35.15
  Top 0.406: C5.1 79.37,31.92 79.37,35.15 v80.18,35.96 | 80.71,73.18 80.61,73.08 80.61,72.52 v80.18,72.09 | 81.17,73.18 81.2,73.2 C4.1 81.15,74.98 80.96,74.79 | 74.42,72.02 85.13,72.02 85.17,71.98 | 85.17,71.98 85.17,72.29 84.68,72.78 78.04,72.78 77.77,72.51 77.77,72.2 84.62,72.2 84.73,72.31 84.64,72.31 84.48,72.48 77.93,72.48 77.88,72.53 75.97,72.53 74.91,73.59 84.77,73.59 84.79,73.57 81.51,73.57 81.4,73.68 81.4,74.79 80.96,74.79 | 80.96,74.79 80.96,73.79 80.87,73.7 80.63,73.7 80.49,73.55 | 77.17,71.79 85.24,71.79 | 85.24,71.79 85.31,71.85 85.3,71.85 85.17,71.98 | 85.24,71.79 84.92,71.46 77.5,71.46 77.32,71.64 77.32,71.92
  Top 0.5: U$9.P$1 v80.18,35.96 arc90 v80.18,35.96
  Top 0.6: 80.9,73.22 80.87,73.18
  Top 0.61: U$19.P$1 85.46,73.18 85.13,73.18
  Top 0.8: 75.05,70.83 arc90 LM1.4 | v80.18,73.18 80.71,73.18 80.87,73.18 81.17,73.18 85.13,73.18 85.27,73.18 C1.+
  Top 1: v80.18,73.18 74.79,73.18 LM1.4
  Bottom 0.5: 80.18,73.18 arc-90 v80.18,73.18
  Bottom 1.27: v80.18,35.96 80.18,73.18
VDD  (via drill 0.3, 0.5)
  Top 0.254: 24.04,53.23 24.04,50.51 22.77,49.24 U$31.48 18.25,49.24 16.76,47.76 | 24.04,53.23 24.04,53.31 27.19,53.31 28.61,54.73 U$31.19 28.61,60.99 27.25,62.34 27.25,63.62 27.36,63.63 | U$31.64 30.87,47.29 31.3,47.72 31.3,49.24 U$31.1 34.98,49.24 C46.2 | 22.11,63.26 U$31.32 22.11,58.68 22.11,55.16 24.04,53.23 | 22.11,63.26 C47.2 | 27.36,63.63 C48.2 | 29.69,47.47 29.69,48.07 30.74,49.12 31.59,49.12 31.64,49.07 31.64,48.77 33.37,47.04 37.19,47.04 | 20.96,49.21 20.06,49.21 20.06,48.79 18.98,48.79 18.53,49.24 17.77,49.24 16.39,47.86 14.67,47.86 14.64,47.82 | 14.64,47.82 14.64,47.06 14.68,47.1 18.77,47.1 19.39,47.72 19.39,48.65 19.52,48.78 20.71,48.78 20.71,48.79 | 20.71,48.79 20.54,48.96 20.24,48.96 20.25,48.97 20.25,49.12 20.32,49.05 21.31,49.05 21.13,48.87 20.81,48.87 20.86,48.82 21.51,48.82 21.48,48.79 20.71,48.79 | 20.71,48.79 20.73,48.81 23.3,48.81 24.66,50.17 24.66,52.81 26.83,52.81 28.64,54.62 28.62,54.64 28.62,55.58 26.81,53.78 23.94,53.78 22.28,55.44 22.28,57.37 21.92,57.73 21.83,57.84 21.72,58.68 21.72,55.21 23.87,53.06 23.87,50.02 22.86,49.02 21.41,49.02 21.38,49.05 23.01,49.05 23.15,48.92 | 23.15,48.92 | 23.15,48.92 24.49,50.27 24.32,50.27 23.19,49.13 23.19,49.41 24.15,50.37 24.42,50.37 24.49,50.44 24.49,52.9 24.61,53.03 26.81,53.03 26.96,53.18 24.27,53.18 24.18,53.09 24.18,50.49 24.24,50.42 24.24,52.89 24.38,53.02 26.74,53.02 28.51,54.78 28.51,55.23 28.49,55.25 28.49,55.04 26.98,53.53 26.98,53.73 27.02,53.77 27.05,53.77 28.36,55.08 28.35,55.08 26.73,53.45 24.03,53.45 23.94,53.55 26.54,53.55 26.63,53.65 23.87,53.65 22.24,55.27 22.06,55.27 21.91,55.12 21.91,57.61 21.89,57.64 21.89,58.55 21.68,58.76 21.68,59.74 22,60.05 22,62.87 21.67,63.19 21.67,59.89 21.64,59.86 21.64,59.88 21.95,60.19 21.95,62.71 21.77,62.89 21.77,60.1 21.79,60.08 21.79,62.95 22,63.16 22.02,63.16 22.11,63.25 22.11,63.26
  Top 0.254: 22.11,63.26 22.11,63.39 21.68,63.82 21.68,63.36 21.71,63.34 21.79,63.34 21.86,63.41 21.77,63.5 21.62,63.5 21.4,63.72 21.4,58.8 21.6,58.6 21.6,62.66 21.72,62.78 21.72,63.23 21.65,63.3 21.65,57.66 21.84,57.47 21.84,55.2 23.99,53.04 23.99,50.04 23.03,49.07 20.53,49.07 20.25,48.8 19.72,48.8 19.37,48.45 19.37,47.31 20.41,46.27 19.63,46.27 18.71,47.19 18.37,47.19 18.28,47.29 15.91,47.29 15.86,47.23 17.46,47.23 17.69,47.46 16.35,47.46 16.3,47.41 17.38,47.41 17.59,47.62 16.96,47.62 16.85,47.73 16.85,47.74 16.66,47.94 16.77,47.94 17.87,49.05 18.73,49.05 18.96,48.82 19.77,48.81 19.91,48.82 20.05,48.81 20.09,48.83 19.42,48.83 19.18,48.6 19.18,47.5 19.19,47.49 19.19,48.32 18.62,48.9 18.2,48.9 18.13,48.82 18.01,48.82 16.96,47.78 16.99,47.78 | 16.99,47.78 17.68,47.78 17.76,47.86 17.39,47.86 17.32,47.93 17.35,47.93 18.17,48.75 18.53,48.75 19.02,48.26 19.02,47.79 19.07,47.74 19.07,48.65 19.04,48.68 18.33,48.68 18.23,48.58 18.18,48.58 17.74,48.14 18.77,48.14 18.9,48.01 18.9,48.09 18.5,48.49 18.4,48.49 18.21,48.3 18.12,48.3 18.1,48.28 18.51,48.28 18.54,48.25 18.54,47.36 19.98,45.92 | 22.11,63.26 | 27.75,62.03 27.75,63.48 27.68,63.55 27.6,63.55 27.43,63.39 27.43,62.36 27.66,62.13 27.66,63.24 27.61,63.29 27.61,62.32 28.6,61.33 28.6,60.86 28.6,61.34 27.83,62.11 27.83,66.42 26.31,67.95 19.91,67.95 19.16,68.69 19.16,74.51 19.34,74.69 18.79,74.69 18.77,74.67 18.77,68.42 19.64,67.55 25.68,67.55 27.17,66.06 27.17,62.44 27.53,62.08 27.53,65.09 27.35,65.27 27.35,65.18 | 27.35,65.18 27.35,63.63 27.36,63.63 | 27.35,65.18 27.66,65.5 27.66,66.26 26.13,67.8 20.06,67.8 19.27,68.59 19.27,74.57 19.04,74.79 19.04,68.33 19.61,67.76
  Top 0.254: 11.9,54.73 11.9,56.73 11.89,56.74 11.89,54.79 11.74,54.64 11.69,54.68 11.69,56.7 11.53,56.7 U$32.P$8 | 40.63,52.05 40.69,52.12 40.69,56.53 40.55,56.68 40.37,56.68 | 40.52,56.28 40.52,52.15 40.6,52.07 40.13,52.07 40.05,52.15 40.05,56.52 40.21,56.68 40.37,56.68 | 40.37,56.68 v40.37,56.49 | 14.67,47.69 14.67,47.82 | 14.67,47.82 14.67,48.18 15.43,48.94 17.36,48.94 17.57,48.73 15.43,48.73 14.81,48.1 14.91,48.1 14.94,48.07 16.37,48.07 16.85,48.55 15.47,48.55 15.45,48.54 15.43,48.54 15.17,48.27 16.32,48.27 16.42,48.38 15.5,48.38 15.48,48.4 16.01,48.4 16.06,48.36 | 14.64,47.82 14.67,47.82 | 16.99,47.78 v16.99,47.76 | v16.03,47.71 16.06,47.71 16.06,47.56 | 1.21,47.03 2.87,47.03 3.15,46.75 3.15,45.15 2.91,44.91 1.33,44.91 1.14,45.09 1.14,46.63 1.44,46.92 2.72,46.92 3.03,46.61 3.03,45.31 2.79,45.07 1.38,45.07 1.3,45.15 1.3,45.94 1.38,46.03 1.38,46.22 1.94,46.78 2.66,46.78 2.92,46.53 2.92,45.47 2.69,45.24 1.5,45.24 1.49,45.22 1.49,45.88 1.51,45.9 1.51,46.22 1.65,46.35 1.75,46.35 2.01,46.6 2.63,46.6 2.73,46.5 | 2.73,46.5 2.79,46.45 2.79,45.62 2.59,45.43 | 2.59,45.43 1.63,45.43 1.6,45.4 | 1.6,45.4 1.6,45.94 1.69,46.04 1.69,46.12 | 1.69,46.12 2,46.42 2.57,46.42 2.65,46.34 2.65,45.77 2.46,45.58 1.77,45.58 1.75,45.6 1.75,46.09 1.84,46.18 2.42,46.18 2.52,46.28 2.52,45.85 2.44,45.77 2.13,45.77 2.1,45.74 1.99,45.74 1.95,45.79 1.95,45.95 1.93,45.98 2.35,45.98 2.38,46 2.27,46 2.15,46.12 | v1.63,45.4 1.6,45.4 | v2.64,45.4 2.59,45.4 2.59,45.43 | v2.64,46.46 2.73,46.46 2.73,46.5 | 1.69,46.12 1.63,46.12 v1.63,46.46
  Top 0.305: U$32.P$8 11.53,54.5 | C49.2 36.53,47.7 C46.2 | 31.3,47.72 31.33,47.7 v32.37,47.7
  Top 0.406: C41.2 4.9,74.09 4.62,73.81 | 11.53,54.5 11.5,54.5 11.49,54.49 | R182.2 40.3,54.77 INDUCTOR.1 v40.36,56.49 v40.37,56.49 | R_CLT_UP2.2 2.87,53.64 3.49,54.26 3.68,54.45 | C49.2 40.3,47.51 v40.37,47.7 | C_VDDA3.2 16.06,47.56 16.76,47.76 | 32.43,47.63 v32.37,47.7 | C48.2 27.31,66.28 25.82,67.77 19.76,67.77 19.01,68.52 19.01,77.43 LD1117-33C.4 | 19.08,47.19 20.24,46.04 20.24,43.64 24.61,39.27 39.46,39.27 40.72,38.02 40.71,38.01 v40.71,36.89 40.72,36.87 OK3.4
  Top 0.61: JP5.1 11.49,54.49 13.02,54.49 C53.2 13.08,54.45 13.05,54.49 | JP2.6 4.16,9.6 2.79,10.97 2.79,23.99 0.61,26.17 0.61,51.38 3.49,54.26 | 5.86,9.88 5.8,9.94 3.99,9.94 2.96,10.97 2.96,27.21 0.93,29.24 0.93,49.79 1.64,50.5 3.27,50.5 3.36,50.59 3.36,52.62 4.78,54.04 13.25,54.04 13.08,54.21 13.08,54.52 13.05,54.49 | 13.05,54.49 4.17,54.49 2.44,56.22 2.44,71.25 5.44,74.25 15.58,74.25 16.79,75.46 16.79,79.66 15.98,80.48 8.79,80.48 0.98,72.66 0.98,26.12 2.7,24.39 2.7,26.83 1.18,28.36 1.18,26.44 2.31,25.31 2.31,26.7 1.47,27.54 1.47,26.83 2.02,26.28 1.94,26.28 1.44,26.78 1.44,27.91 1.05,28.3 1.05,46.32 1.05,50 2.09,51.04 2.56,51.04 2.6,51.08 2.6,52.41 4.28,54.1 3.83,54.1 2.14,52.41 2.14,51.33 2.19,51.27 2.07,51.27 1.43,50.64 1.43,51.65 1.36,51.73 1.4,51.73 1.8,52.14 1.8,51.46 1.69,51.35 0.84,51.35 0.68,51.51 0.68,72.44 8.79,80.56 17.14,80.56 18.03,79.68 18.03,77.25 15.54,74.76 4.82,74.76 1.5,71.45 1.5,52.47 1.33,52.3 1.33,52.68 2.97,54.32 2.97,54.54 1.8,55.71 1.8,53.41 1.82,53.39 1.82,53.77 2.53,54.49 2.46,54.49 2.07,54.87 2.07,54.41 2.15,54.34 2.13,54.34 1.42,53.63 1.42,72.48 8.97,80.03 15.76,80.03 16.11,79.68 16.11,75.84 15.38,75.11 4.51,75.11 1.6,72.2 1.91,72.2 9.32,79.6 15.43,79.6 15.88,79.16 15.88,76.16 15.07,75.35 5.69,75.35 | 5.67,75.35 5.69,75.35 | 5.69,75.35 9.66,79.31 15.08,79.31 15.76,78.64 15.76,76.74 14.79,75.76 7.06,75.76 7.03,75.8 7.03,75.99 9.92,78.88 14.8,78.88 15.41,78.26 15.41,76.98 14.65,76.22 7.96,76.22 | 7.65,76.22 7.96,76.22 | 7.96,76.22 10.21,78.48 14.53,78.48 15.12,77.88 15.12,77.47 14.2,76.56 8.86,76.56 8.84,76.58 8.93,76.58 10.41,78.06 11.6,78.06
  Top 0.61: 11.6,78.06 14.54,78.06 14.67,77.93 14.67,77.61 13.99,76.93 9.56,76.93 9.45,76.82 9.45,76.87 10.39,77.8 | 37.19,47.04 37.23,47.08 40.39,47.08 40.4,47.1 40.4,47.67 | 40.4,47.67 40.4,47.78 40.32,47.86 36.27,47.86 35.06,49.07 33.43,49.07 32.73,48.37 31.64,48.37 31.44,48.56 31.44,49.05 31.25,48.86 30.8,48.86 29.9,47.96 29.9,47.59 30.01,47.48 33.51,47.48 33.69,47.3 36.41,47.3 36.52,47.41 39.64,47.41 39.73,47.49 40.2,47.49 40.17,47.52 36.01,47.52 34.9,48.63 33.5,48.63 32.82,47.94 30.39,47.94 30.85,48.4 31.08,48.4 31.68,47.79 33.93,47.79 34.15,47.57 35.64,47.57 35.07,48.14 34.69,48.14 34.66,48.17 33.35,48.17 33.61,47.91 34.61,47.91 34.72,47.8 35.21,47.8 | v40.37,47.7 40.4,47.67 | 19.98,45.92 19.98,43.45 24.41,39.02 39.43,39.02 40.52,37.94 40.52,36.88 40.63,36.77 40.97,36.77 41,36.8 41,38.28 39.68,39.59 24.18,39.59 20.28,43.49 20.28,46.16 19.19,47.25 18.57,47.25 18.57,47.12 19.68,46.01 19.68,43.35 24.02,39.01 30.4,39.01 30.43,39.04 | U$6.P$1 11.72,78.19 11.6,78.06
  Top 0.813: LD1117-33C.4 11.88,77.49 | 11.88,77.49 8.3,77.49 4.62,73.81 2.01,71.2 2.01,56.12 3.68,54.45 4.73,54.45 JP5.1 | C37.+ 11.7,77.31 11.88,77.49 | 19.08,47.19 18.52,47.76 v17.94,47.76 | v1.63,46.46 1.19,46.46 1.05,46.32
  Bottom 0.254: 17.99,47.59 17.66,47.26 13.15,47.26 11.99,46.1 1.63,46.1 1.33,46.39 1.33,46.97 3.14,48.78 17.38,48.78 18.23,47.93 18.23,47.62 17.82,47.21 12.84,47.21 11.93,46.3 | 17.72,48.04 17.94,48.04 v17.94,47.76 | 40.77,37.07 41.81,36.03 | 41.81,36.03 41.81,30.46 39.69,28.34 28.05,28.34 28.05,28.54 31.64,28.54 31.64,28.5 31.65,28.5 31.65,30.15 32.15,30.15 32.15,30.11 32.18,30.11 32.18,28.69 32.21,28.69 32.21,30.2 33.85,30.2 33.85,28.52 34.46,28.52 34.46,28.55 34.39,28.55 34.39,30.1 33.97,30.1 33.97,30.05 33.95,30.05 33.95,28.69 34.18,28.69 34.18,28.75 34.16,28.75 34.16,30 30,30 30,28.64 29.82,28.64 29.82,30.11 29.66,30.11 29.66,28.65 29.46,28.65 29.46,30.11 21.98,30.11 20.61,31.47 20.61,37.19 22.11,38.69 24.68,38.69 31.54,45.56 31.54,47.45 32.08,47.98 32.54,47.98 32.86,47.67 | 32.86,47.67 32.86,45.78 24.9,37.83 22.84,37.83 21.9,36.88 21.9,31.23 22.77,30.35 28.82,30.35 29.32,29.86 | 29.42,29.76 29.32,29.86 | 29.32,29.86 22.08,29.86 20.79,31.15 20.79,37.11 22.14,38.46 24.77,38.46 31.74,45.43 31.74,47.48 32.07,47.81 32.25,47.81 32.17,47.72 32.17,45.73 31.88,45.44 31.88,45.4 31.91,45.44 31.91,47.44 31.98,47.5 31.98,47.57 32.02,47.53 32.02,45.67 32.11,45.76 32.66,45.76 32.64,45.78 32.64,47.62 32.04,47.02 32.04,45.61 24.71,38.29 22.2,38.29 20.94,37.03 20.94,36.3 21.07,36.43 21.07,36.98 22.28,38.18 22.5,38.18 21.28,36.97 21.28,36.86 20.97,36.54 20.97,31.3 22.01,30.26 22.66,30.26 | 22.66,30.26 21.31,31.61 21.15,31.61 21.13,31.58 20.59,31.58 20.59,31.35 21.63,30.31 21.63,30.93 21.12,31.44 21.12,31.35 22.1,30.37 22.38,30.37 22.39,30.38 22.28,30.38 21.73,30.93 21.73,36.83 21.72,36.84 21.72,31.17 21.61,31.06 21.61,31.12 21.26,31.47 21.26,36.37 21.5,36.62 21.5,31.61 21.55,31.56 21.55,30.94 22.44,30.04 36.02,30.04 36.13,29.94 36.13,28.53 36.06,28.47 36.06,30.14 36.07,30.15 36.07,28.73 36.34,28.47 39.54,28.47 41.69,30.62 41.69,36.48 41.01,37.17 41.01,33.3 39.89,32.18 39.89,36.55 40.49,37.15 40.49,33.19 40.5,33.18 40.5,36.55 40.31,36.74 40.31,33.09 40.18,32.95 40.06,32.95 40.03,32.92 40.03,36.46 40.2,36.63 40.2,32.88 40.19,32.87
  Bottom 0.254: 22.73,30.32 22.66,30.32 22.66,30.26 | 40.03,36.4 39.91,36.52 39.91,38.31 40.33,38.73 41.47,38.73 41.8,38.4 41.8,36.03 | 40.71,37.99 41,37.99 41.11,38.1 41.11,37.9 41.13,37.88 41.13,37.59 41.01,37.48 40.34,37.48 40.3,37.52 40.3,38.07 40.2,38.16 40.89,38.16 40.96,38.23 41.21,38.23 41.23,38.2 41.23,37.23 41.2,37.2 41.2,37.24 41.11,37.33 40.32,37.33 40.15,37.16 40.15,38.21 40.33,38.4 41.37,38.4 41.39,38.38 41.39,37.02 41.47,36.94 41.3,36.94 41.01,37.23 40.81,37.23 40.74,37.15 40.28,37.15 40.02,36.89 40.02,38.07 40.06,38.12 40.06,38.28 40.35,38.57 41.32,38.57 41.4,38.65 41.4,38.56 41.6,38.36 41.6,36.22 41.8,36.01 41.8,36.03 | 40.71,37.99 40.43,37.99 40.54,37.88 40.54,37.58 40.62,37.66 40.91,37.66 41.07,37.82 | 41.07,37.82 | 41.07,37.82 41.03,37.78 40.65,37.78 40.68,37.81 40.71,37.81 | v40.69,37.86 v40.71,37.86 40.71,37.99 | 41.81,36.03 41.8,36.03 | 31.07,44.86 30.91,44.86 30.91,48.01 31.27,48.37 33.45,48.37 33.66,48.17 33.66,46.58 32.65,45.57 31.35,45.57 31.05,45.27 31.05,47.88 31.32,48.15 32.86,48.15 | v33.32,47.69 33.32,46.71 33.23,46.61 33.23,46.6 33.24,46.62 33.24,47.99 33.17,47.92 33.01,47.92 33.05,47.88 33.05,46.18 33.49,46.62 33.49,48.03 33.37,48.15 32.86,48.15 | v33.32,47.69 33.32,47.99 33.23,48.08 32.73,48.08 32.68,48.03 32.74,48.03 32.91,47.86 32.91,47.95 32.8,48.05 31.86,48.05 31.73,47.92 31.73,47.91 31.47,47.65 | 31.47,47.65 31.44,47.62 31.44,45.71 31.38,45.64 31.38,45.63 31.27,45.53 31.27,47.72 31.6,48.04 31.38,48.04 31.19,47.85 31.19,47.7 31.2,47.69 31.2,45.56 31.05,45.41 31.05,45.05 31.1,44.99 | v31.4,47.7 31.47,47.7 31.47,47.65
  Bottom 0.254: v33.33,47.69 v33.32,47.69 | 32.86,48.15 32.86,47.67 | 12.04,46.14 10.7,44.8 1.26,44.8 1.14,44.92 1.14,46.9 3.03,48.79 3.92,48.79 1.31,46.19 1.31,44.96 1.39,45.04 1.63,45.04 | 1.63,45.04 10.71,45.04 11.57,45.9 11.57,45.92 11.5,46 1.44,46 | 1.63,45.04 v1.63,45.4
  Bottom 0.406: v32.37,47.7 32.43,47.63 32.43,45.68 24.83,38.08 22.69,38.08 21.21,36.6 21.21,31.84 22.73,30.32 31.94,30.32 | v40.71,36.89 40.71,33.32 37.71,30.32 31.94,30.32 | 31.94,30.32 31.94,28.64 R_CLT_UP3.2 R_CLT_UP5.2
  Bottom 0.5: R_CLT_UP4.2 R_CLT_UP1.2 R_CLT_UP3.2
  Bottom 0.61: 11.93,46.3 2.06,46.3 1.58,46.78 1.58,46.8 3.25,48.47 17.3,48.47 17.72,48.04 3.4,48.04 2.17,46.81 12.29,46.81 12.91,47.42 3.02,47.42 2.81,47.21 12.01,47.21 12.13,47.33 | 40.19,32.87 40.19,32.29 38.02,30.13 36.47,30.13 36.28,29.94 36.28,28.81 36.38,28.71 39.35,28.71 41.37,30.72 41.37,36.1 41.07,36.39 41.07,31.08 39.21,29.22 36.94,29.22 36.73,29.01 36.73,29.7 36.61,29.82 38.92,29.82 39.09,29.66 39.09,29.81 40.58,31.3 40.58,32.85 40.61,32.87 40.61,31.99 38.53,29.91 38.53,30.2 40.04,31.71 | 1.44,46 1.59,45.85 1.59,45.34 1.6,45.35 10.61,45.35 11.06,45.79 11.28,45.79 11.25,45.76 1.91,45.76
  Bottom 0.813: v40.37,47.7 v40.37,56.49 | v17.94,47.76 2.92,47.76 v1.63,46.46
VPP
  Top 0.406: C3.1 U$1.+VOUT
  Top 0.61: U$21.P$1 85.46,55.84 C2.+
  Top 1: LM1.3 77.04,63.39 | C2.+ 85.45,56.43 78.81,56.43 U$1.+VOUT
  Top 1.27: 77.04,63.39 U$1.+VOUT
WP
  Top 0.254: U$31.33 20.16,57.99 18.82,59.32 U$32.P$3
Y
  Top 0.406: U$70.6 66.61,48.46 65.2,49.87 61.72,49.87 60.53,51.06 60.53,54.04 | 62.52,54.04 C81.1 | 64.88,54.11 R60.1
  Top 0.61: R20.2 60.53,54.04 62.52,54.04 | C81.1 64.88,54.11

## Text on the board
Top: by_Agus
tPlace: Copyright @ PUI-SKO2019 | +5V_A | GND_A | +3.3V_A | +5V_B | +12V_A | LOADER | SCK | +12V_B | TEMP_BMS | HV_IN | CONTACTOR | TEMP | CAN_RX | MASTER Battery Management System | CHARGE_IN | OUT_FAN | CAN_TX | HIGH VOLTAGE | GND_B | TEMP_1 | TEMP_2 | TEMP_3 | TEMP_4 | CANH | +12V | GND | + HV | - HV | SPI_CONN | CHARGE_OUT | CANL | LED